# EAGLE schematic power_control (EAGLE 7.2.0)
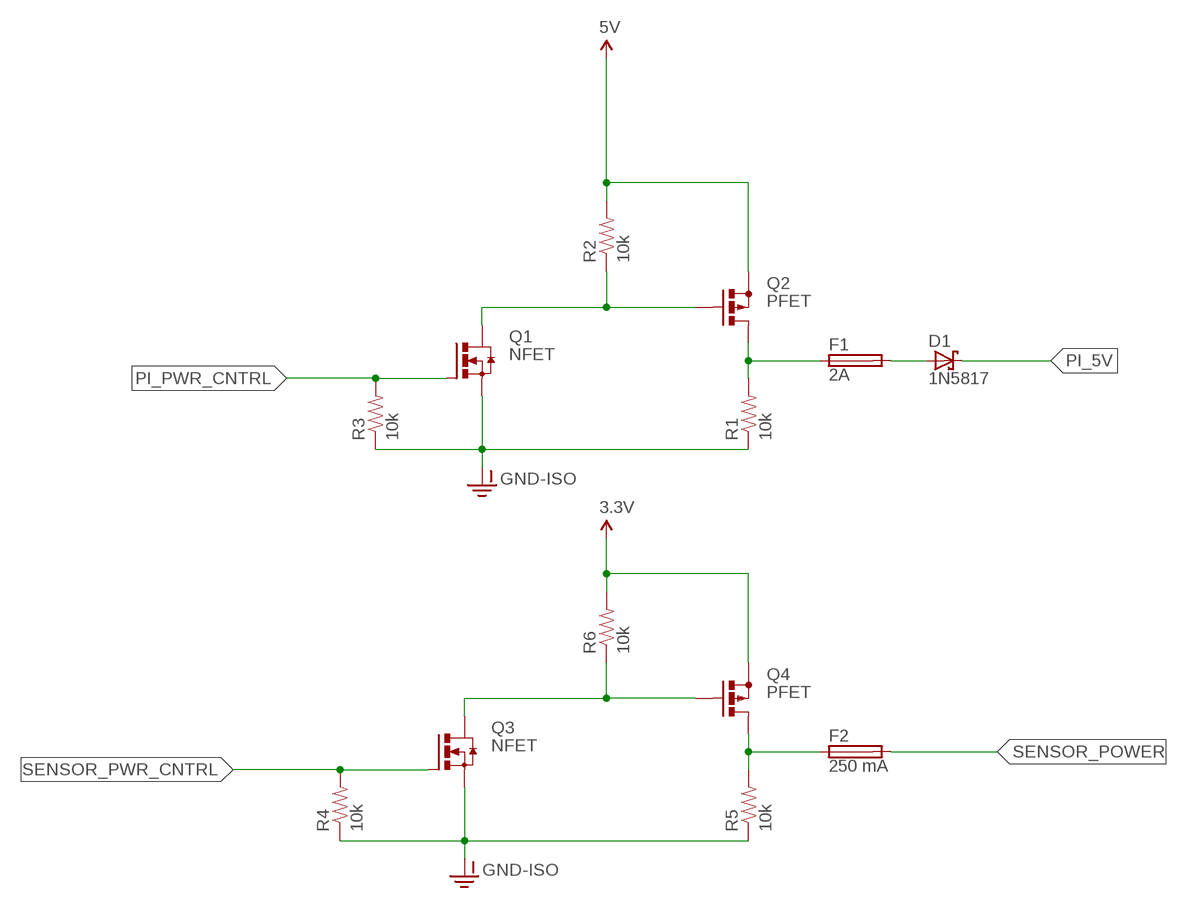
[diagram p0: schematic, sheet 1]

## Parts
D1  1N5817  SCHOTTKY-DIODECB429-15  [CB429-15]
F1  2A  FUSEPICOFUSE  [PICOFUSE]
F2  250 mA  FUSEPICOFUSE  [PICOFUSE]
Q1  NFET  IRF3704  [TO220AH]
Q2  PFET  PFETBS250  [TO92-OVAL]
Q3  NFET  IRF3704  [TO220AH]
Q4  PFET  PFETBS250  [TO92-OVAL]
R1  10k  RESISTOR1206  [1206]
R2  10k  RESISTOR1206  [1206]
R3  10k  RESISTOR1206  [1206]
R4  10k  RESISTOR1206  [1206]
R5  10k  RESISTOR1206  [1206]
R6  10k  RESISTOR1206  [1206]

## Nets
3.3V: Q4.3(S) R6.2
5V: Q2.3(S) R2.2
GND-ISO: Q1.E(S) Q3.E(S) R1.1 R3.1 R4.1 R5.1
N$1: Q3.C(D) Q4.2(G) R6.1
N$2: Q1.C(D) Q2.2(G) R2.1
N$4: F1.1 Q2.1(D) R1.2
N$5: D1.A F1.2
N$6: F2.1 Q4.1(D) R5.2
PI_5V: D1.C
PI_PWR_CNTRL: Q1.B(G) R3.2
SENSOR_POWER: F2.2
SENSOR_PWR_CNTRL: Q3.B(G) R4.2

## Library data of the parts
D1 = adafruit:SCHOTTKY-DIODE: Schottky Diode
F1 F2 = fuse:FUSE: Fuse; OC_FARNELL: unknown; OC_NEWARK: unknown
Q1 Q3 = transistor-power:IRF3704: SMPS MOSFET HEXFET® Power MOSFET Source: http://www.irf.com/product-info/datasheets/data/irf3704.pdf
Q2 Q4 = adafruit:PFET: P-CHANNEL MOS FET
R1-R6 = SparkFun-Resistors:RESISTOR: Resistor Basic schematic elements and footprints for 0603, 1206, and PTH resistors.